# Altium schematic sheet PDB.rev1.SchDoc
size A4
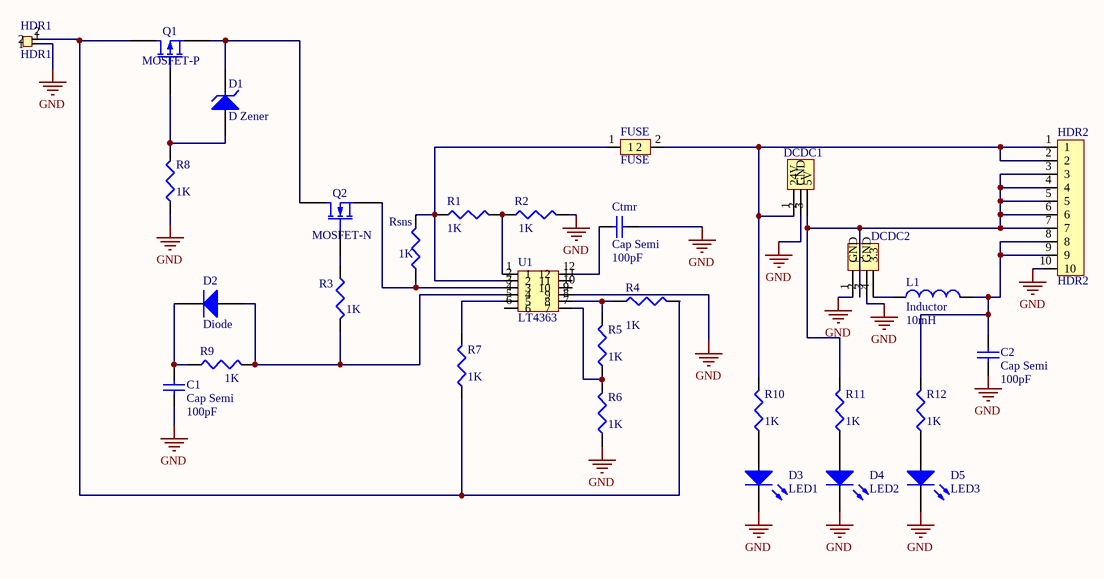
[diagram p0: PDB.rev1.SchDoc]

## Parts
C1  Cap Semi  value 100pF  [C1206]
C2  Cap Semi  value 100pF  [C1206]
Ctmr  Cap Semi  value 100pF  [C1206]
D1  D Zener  [ZENER DIODE]
D2  Diode  [diode]
D3  LED1  [LED]
D4  LED2  [LED]
D5  LED3  [LED]
DCDC1  DCDC1  [DCDC1]  (value not drawn)
DCDC2  DCDC2  [DCDC2]  (value not drawn)
FUSE  FUSE  [FUSE]
HDR1  HDR1  [HDR1]
HDR2  HDR2  [HDR2]
L1  Inductor  value 10mH  [0402-A]
Q1  MOSFET-P  [MOSFET]
Q2  MOSFET-N  [MOSFET]
R1  value 1K  [J1-0603]
R2  value 1K  [J1-0603]
R3  value 1K  [J1-0603]
R4  value 1K  [J1-0603]
R5  value 1K  [J1-0603]
R6  value 1K  [J1-0603]
R7  value 1K  [J1-0603]
R8  value 1K  [J1-0603]
R9  value 1K  [J1-0603]
R10  value 1K  [J1-0603]
R11  value 1K  [J1-0603]
R12  value 1K  [J1-0603]
Rsns  value 1K  [J1-0603]
U1  LT4363  [LT4363]

## Nets
GND: C1.1 C2.1 Ctmr.1 D3.2(K) D4.2(K) D5.2(K) DCDC1.2(GND) DCDC2.1(GND) DCDC2.3(GND) HDR1.1 HDR2.10 R2.2 R6.1 R8.1 U1.9
NetC1_2: C1.2 D2.2(K) R9.1
NetC2_2: C2.2 HDR2.8 HDR2.9 L1.2 R12.2
NetCtmr_2: Ctmr.2 U1.12
NetD1_1: D1.1(A) Q1.2(G) R8.2
NetD1_2: D1.2(K) Q1.3(S) Q2.1(D)
NetD2_1: D2.1(A) R3.2 R9.2 U1.4
NetD3_1: D3.1(A) R10.1
NetD4_1: D4.1(A) R11.1
NetD5_1: D5.1(A) R12.1
NetDCDC1_1: DCDC1.1(24V) FUSE.2 HDR2.1 HDR2.2 R10.2
NetDCDC1_3: DCDC1.3(5V) DCDC2.2(5) HDR2.3 HDR2.4 HDR2.5 HDR2.6 HDR2.7 R11.2
NetDCDC2_4: DCDC2.4(3.3) L1.1
NetFUSE_1: FUSE.1 R1.1 Rsns.2 U1.2
NetHDR1_2: HDR1.2 Q1.1(D) R4.2 R7.1
NetQ2_2: Q2.2(G) R3.1
NetQ2_3: Q2.3(S) Rsns.1 U1.3
NetR1_2: R1.2 R2.1 U1.1
NetR4_1: R4.1 R5.2 U1.8
NetR5_1: R5.1 R6.2 U1.7
NetR7_2: R7.2 U1.5

Not connected (* = marked no-connect by the designer): U1 6 10 11

## Library data of the parts
C1 C2 Ctmr = Cap Semi: Capacitor (Semiconductor SIM Model); Published: 8-Jun-2000; LatestRevisionDate: 29-May-2009; LatestRevisionNote: IPC-7351 Footprint Added.; PackageReference: C1206; Publisher: Altium Limited; PackageDescription: Chip Capacitor
D1 = D Zener: Zener Diode; Published: 8-Jun-2000; LatestRevisionDate: 17-Jul-2002; LatestRevisionNote: Re-released for DXP Platform.; PackageReference: DIODE-0.7; Publisher: Altium Limited; PackageDescription: Diode, Thru-Hole; 2 Leads; 0.7 in Pin Spacing
D2 = Diode: Default Diode; Published: 8-Jun-2000; LatestRevisionDate: 17-Jul-2002; LatestRevisionNote: Re-released for DXP Platform.; PackageVersion: Sep-1996; PackageReference: SMC; Publisher: Altium Limited; PackageDescription: DO-214-AB/SMC; 2 C-Bend Leads; Body 7.9 x 5.9 mm, inc. leads (LxW); Code_JEDEC: DO-214-AB
D3-D5 = LED3: Typical BLUE SiC LED; Published: 8-Jun-2000; LatestRevisionDate: 17-Dec-2003; LatestRevisionNote: PCB Footprint replaced.; DatasheetVersion: 16-Apr-2002; PackageVersion: 16-Apr-2002; PackageReference: 3.5X2.8X1.9; Publisher: Altium Limited; PackageDescription: SM LED; 2 C-Bend Leads; Body 3.5 x 2.8 x 1.9 mm, inc leads (LxWxH typ)
L1 = Inductor: Code_IEC: 1005; Published: 8-Jun-2000; LatestRevisionDate: 29-May-2009; LatestRevisionNote: IPC-7351 Footprint Added.; PackageReference: 0402-A; Publisher: Altium Limited; PackageDescription: Chip Inductor; Code_JEITA: 0402
Q1 = MOSFET-P: P-Channel MOSFET; Published: 8-Jun-2000; LatestRevisionDate: 17-Jul-2002; LatestRevisionNote: Re-released for DXP Platform.; PackageVersion: 1995/1996; PackageReference: E3; Publisher: Altium Limited; PackageDescription: TO, Flat Index; 3 In-Line, Axial Leads; Body Dia. 4.6mm; Lead Dia. 0.5 mm (max)
Q2 = MOSFET-N: N-Channel MOSFET; Published: 8-Jun-2000; LatestRevisionDate: 17-Jul-2002; LatestRevisionNote: Re-released for DXP Platform.; PackageVersion: 1995/1996; PackageReference: E3; Publisher: Altium Limited; PackageDescription: TO, Flat Index; 3 In-Line, Axial Leads; Body Dia. 4.6mm; Lead Dia. 0.5 mm (max)
R1-R12 Rsns = Res3: Resistor; Published: 8-Jun-2000; LatestRevisionDate: 29-May-2009; LatestRevisionNote: IPC-7351 Footprint Added.; PackageReference: J1-0603; Publisher: Altium Limited; PackageDescription: Chip Resistor